# EAGLE schematic FootKeyboardTrial(16F1459) (EAGLE 6.4)
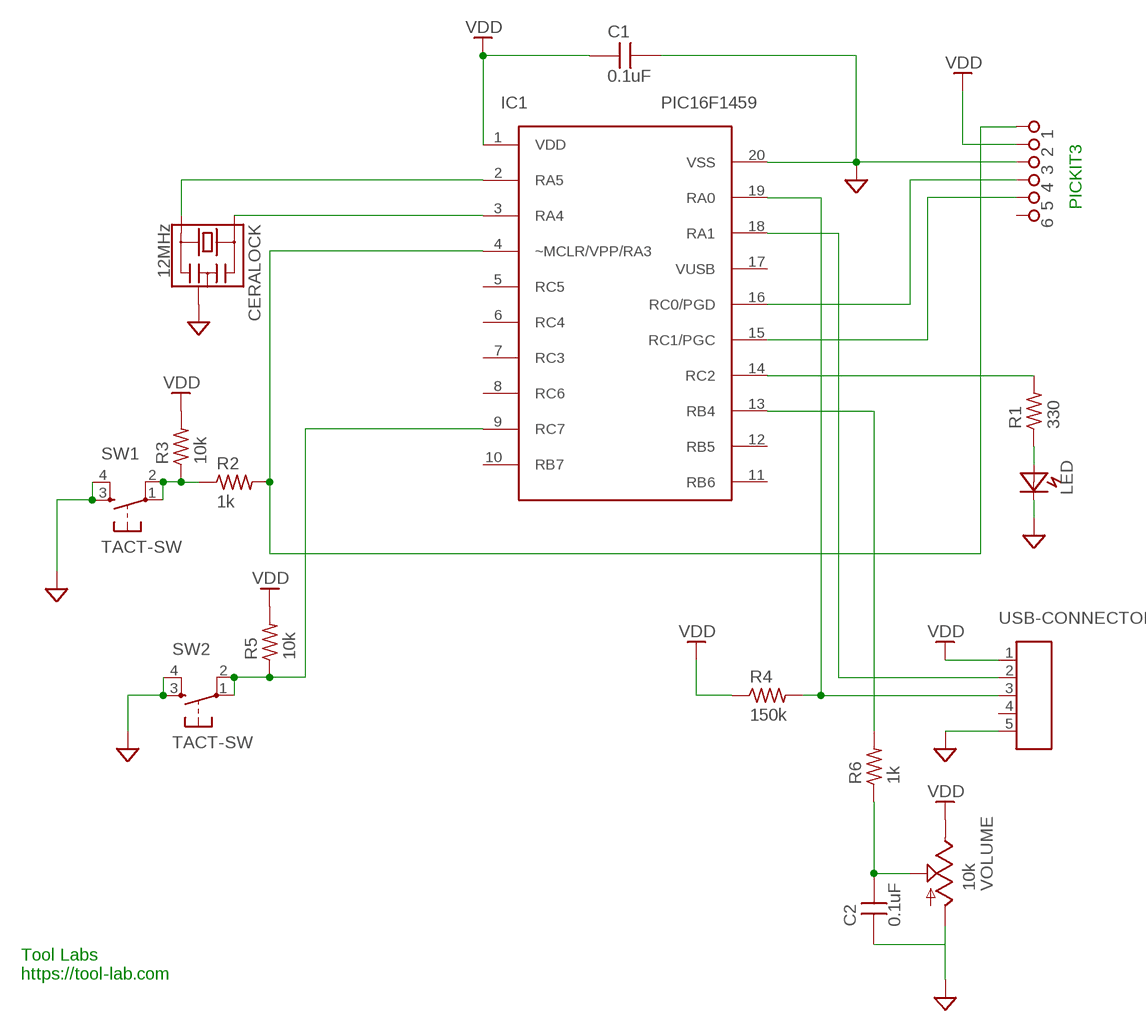
[diagram p0: schematic, sheet 1]

## Parts
1  TP1  [TP1]
2  TP1  [TP1]
3  TP1  [TP1]
4  TP1  [TP1]
5  TP1  [TP1]
6  TP1  [TP1]
C1  0.1uF  CAP10X4  [CAP_10X4]
C2  0.1uF  CAP10X4  [CAP_10X4]
CERALOCK  12MHz  CERALOCK  [CSTLS]
IC1  PIC16F1459  PIC16F145XPIC16F145X  [DIL20]
LED  LED  [LED_3MM_VIRT_2]
R1  330  R0.5W_5P  [R_0.5W_5]
R2  1k  R0.5W_5P  [R_0.5W_5]
R3  10k  R0.5W_5P  [R_0.5W_5]
R4  150k  R0.5W_5P  [R_0.5W_5]
R5  10k  R0.5W_5P  [R_0.5W_5]
R6  1k  R0.5W_5P  [R_0.5W_5]
SW1  TACT-SW  [B3F-10X]
SW2  TACT-SW  [B3F-10X]
USB-CONNECTOR  CON_5P  [CON_HRS_DIP_5]
VOLUME  10k  POTMIDDLE  [POT_MIDDLE]

## Nets
GND: 3.P$1 C1.2 C2.1 CERALOCK.2 IC1.20(VSS) LED.K SW1.3(S) SW1.4(S1) USB-CONNECTOR.5 VOLUME.P$1(A)
N$1: CERALOCK.1 IC1.3(RA4)
N$2: CERALOCK.3 IC1.2(RA5)
N$3: IC1.14(RC2) R1.2
N$4: LED.A R1.1
N$5: 1.P$1 IC1.4(~MCLR/VPP/RA3) R2.2
N$6: R2.1 R3.1 SW1.1(P) SW1.2(P1)
N$7: IC1.19(RA0) R4.2 USB-CONNECTOR.3
N$8: IC1.18(RA1) USB-CONNECTOR.2
N$9: 4.P$1 IC1.16(RC0/PGD)
N$10: 5.P$1 IC1.15(RC1/PGC)
N$11: IC1.9(RC7) R5.1 SW2.1(P) SW2.2(P1)
N$12: SW2.3(S) SW2.4(S1) ; supply symbol labelled GND
N$13: IC1.13(RB4) R6.2
N$14: C2.2 R6.1 VOLUME.P$3(S)
VDD: 2.P$1 C1.1 IC1.1(VDD) R3.2 R4.1 R5.2 USB-CONNECTOR.1 VOLUME.P$2(E)
Unconnected: 6.P$1 IC1.5(RC5) IC1.6(RC4) IC1.7(RC3) IC1.8(RC6) IC1.10(RB7) IC1.11(RB6) IC1.12(RB5) IC1.17(VUSB) USB-CONNECTOR.4

## Notes on the sheet
- PICKIT3
- Tool Labs
  https://tool-lab.com

## Library data of the parts
1-6 = MyLib:TP1: 1 Pin Test Point
C1 C2 = MyLib:CAP: Non polar capacitor
CERALOCK = MyLib:CERALOCK: Ceralock Oscillator
IC1 = MyOriginal:PIC16F145X: PIC16F145X
LED = MyLib:LED: 3mm LED
R1-R6 = MyLib:R: General Resiter 1/8W 1/4W 1/2W V/H
SW1 SW2 = MyLib:TACT-SW: Tacticle Push Switch
USB-CONNECTOR = MyLib:CON_5P: 5P Molex Connector
VOLUME = MyLib:POT: Volume Trimmer Resister